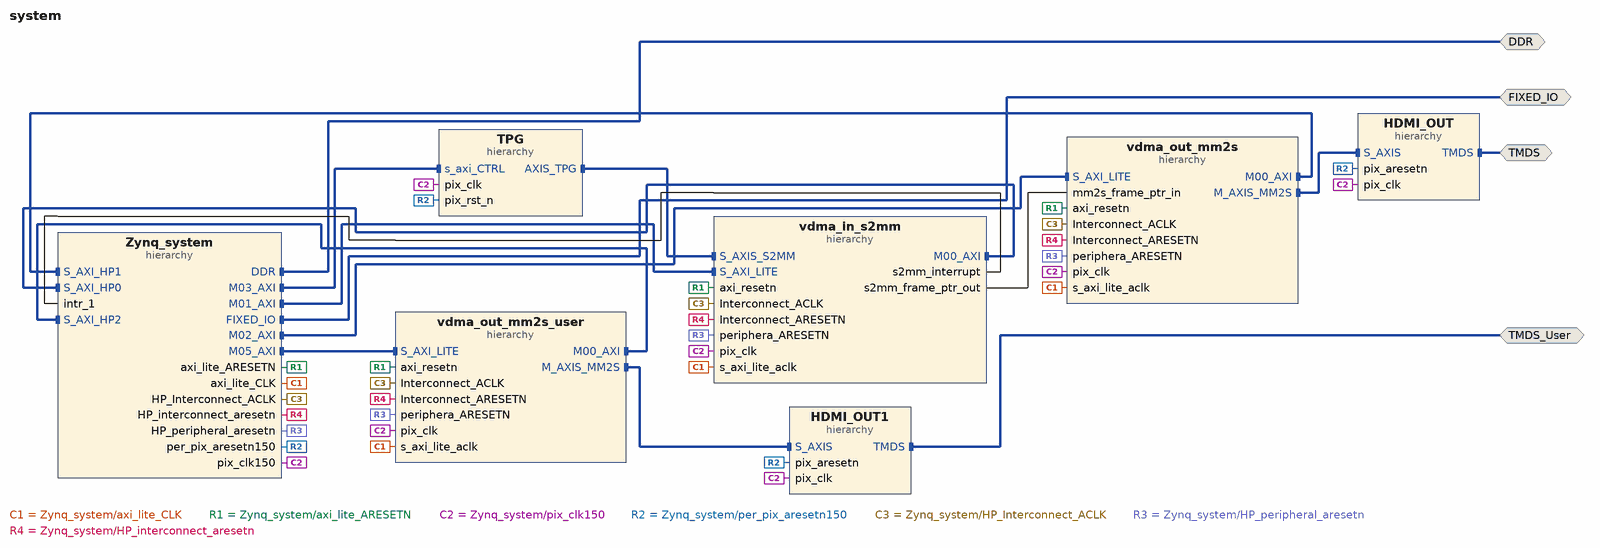
[diagram p0: block diagram of the top level]
# Vivado block design system, xc7z010clg400-1, Vivado 2018.3
create_bd_design system

create_bd_intf_port -mode Master -vlnv xilinx.com:interface:ddrx_rtl:1.0 DDR
create_bd_intf_port -mode Master -vlnv xilinx.com:display_processing_system7:fixedio_rtl:1.0 FIXED_IO
create_bd_intf_port -mode Master -vlnv digilentinc.com:interface:tmds_rtl:1.0 TMDS
create_bd_intf_port -mode Master -vlnv digilentinc.com:interface:tmds_rtl:1.0 TMDS_User

create_bd_cell -type hier vdma_in_s2mm
create_bd_cell -type hier vdma_out_mm2s
create_bd_cell -type hier Zynq_system
create_bd_cell -type hier TPG
create_bd_cell -type hier HDMI_OUT
create_bd_cell -type hier HDMI_OUT1
create_bd_cell -type hier vdma_out_mm2s_user

# ---- hierarchy /vdma_in_s2mm ----
current_bd_instance /vdma_in_s2mm
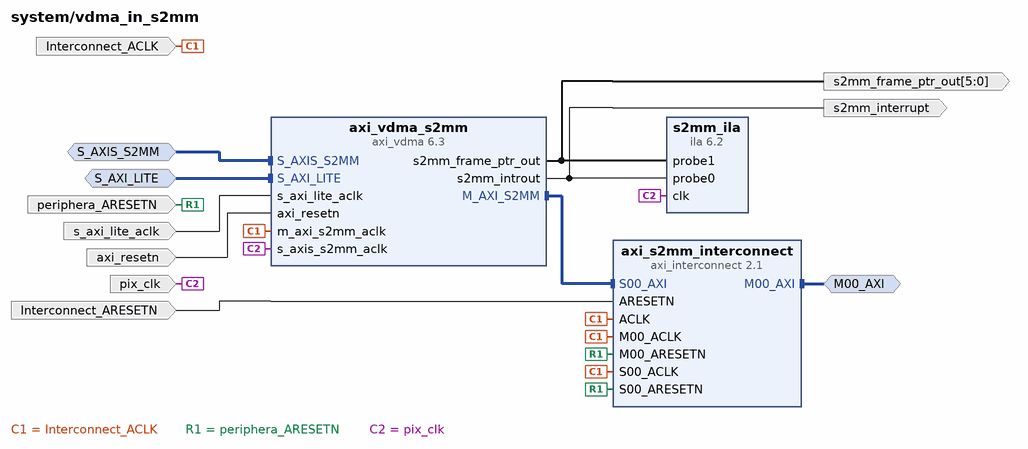
[diagram p1: block diagram inside /vdma_in_s2mm]
create_bd_intf_pin -mode Slave -vlnv xilinx.com:interface:axis_rtl:1.0 S_AXIS_S2MM
create_bd_intf_pin -mode Master -vlnv xilinx.com:interface:aximm_rtl:1.0 M00_AXI
create_bd_intf_pin -mode Slave -vlnv xilinx.com:interface:aximm_rtl:1.0 S_AXI_LITE
create_bd_pin -dir I -type clk Interconnect_ACLK
create_bd_pin -dir I -type rst periphera_ARESETN
create_bd_pin -dir I -type rst Interconnect_ARESETN
create_bd_pin -dir I -type clk s_axi_lite_aclk
create_bd_pin -dir I -type rst axi_resetn
create_bd_pin -dir I -type clk pix_clk
create_bd_pin -dir O -type intr s2mm_interrupt
create_bd_pin -dir O -from 5 -to 0 s2mm_frame_ptr_out

create_bd_cell -type ip -vlnv xilinx.com:ip:axi_vdma:6.3 axi_vdma_s2mm
set_property -dict [list \
  CONFIG.c_include_mm2s 0 \
  CONFIG.c_num_fstores 1 \
  CONFIG.c_s2mm_linebuffer_depth 2048 \
  CONFIG.c_s2mm_max_burst_length 64 \
] [get_bd_cells axi_vdma_s2mm]
create_bd_cell -type ip -vlnv xilinx.com:ip:axi_interconnect:2.1 axi_s2mm_interconnect
set_property -dict {CONFIG.NUM_MI 1} [get_bd_cells axi_s2mm_interconnect]
create_bd_cell -type ip -vlnv xilinx.com:ip:ila:6.2 s2mm_ila
set_property -dict [list \
  CONFIG.C_ENABLE_ILA_AXI_MON false \
  CONFIG.C_MONITOR_TYPE Native \
  CONFIG.C_NUM_OF_PROBES 2 \
  CONFIG.C_PROBE1_WIDTH 6 \
] [get_bd_cells s2mm_ila]

# ---- hierarchy /vdma_out_mm2s ----
current_bd_instance /vdma_out_mm2s
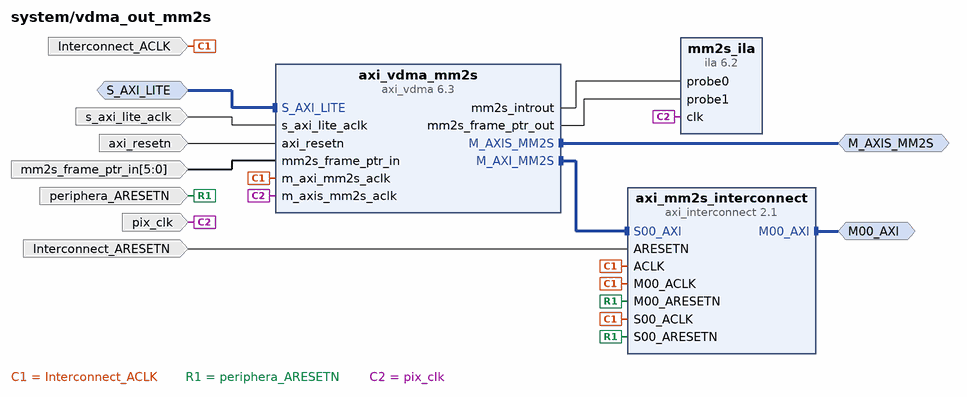
[diagram p2: block diagram inside /vdma_out_mm2s]
create_bd_intf_pin -mode Master -vlnv xilinx.com:interface:aximm_rtl:1.0 M00_AXI
create_bd_intf_pin -mode Slave -vlnv xilinx.com:interface:aximm_rtl:1.0 S_AXI_LITE
create_bd_intf_pin -mode Master -vlnv xilinx.com:interface:axis_rtl:1.0 M_AXIS_MM2S
create_bd_pin -dir I -type clk Interconnect_ACLK
create_bd_pin -dir I -type rst periphera_ARESETN
create_bd_pin -dir I -type rst Interconnect_ARESETN
create_bd_pin -dir I -type clk s_axi_lite_aclk
create_bd_pin -dir I -type rst axi_resetn
create_bd_pin -dir I -type clk pix_clk
create_bd_pin -dir I -from 5 -to 0 -type intr mm2s_frame_ptr_in

create_bd_cell -type ip -vlnv xilinx.com:ip:axi_vdma:6.3 axi_vdma_mm2s
set_property -dict [list \
  CONFIG.c_addr_width 32 \
  CONFIG.c_include_mm2s 1 \
  CONFIG.c_include_s2mm 0 \
  CONFIG.c_m_axis_mm2s_tdata_width 32 \
  CONFIG.c_mm2s_genlock_mode 3 \
  CONFIG.c_mm2s_linebuffer_depth 2048 \
  CONFIG.c_mm2s_max_burst_length 32 \
  CONFIG.c_num_fstores 1 \
] [get_bd_cells axi_vdma_mm2s]
create_bd_cell -type ip -vlnv xilinx.com:ip:axi_interconnect:2.1 axi_mm2s_interconnect
set_property -dict {CONFIG.NUM_MI 1} [get_bd_cells axi_mm2s_interconnect]
create_bd_cell -type ip -vlnv xilinx.com:ip:ila:6.2 mm2s_ila
set_property -dict [list \
  CONFIG.C_ENABLE_ILA_AXI_MON false \
  CONFIG.C_MONITOR_TYPE Native \
  CONFIG.C_NUM_OF_PROBES 2 \
  CONFIG.C_PROBE1_WIDTH 6 \
] [get_bd_cells mm2s_ila]

# ---- hierarchy /Zynq_system ----
current_bd_instance /Zynq_system
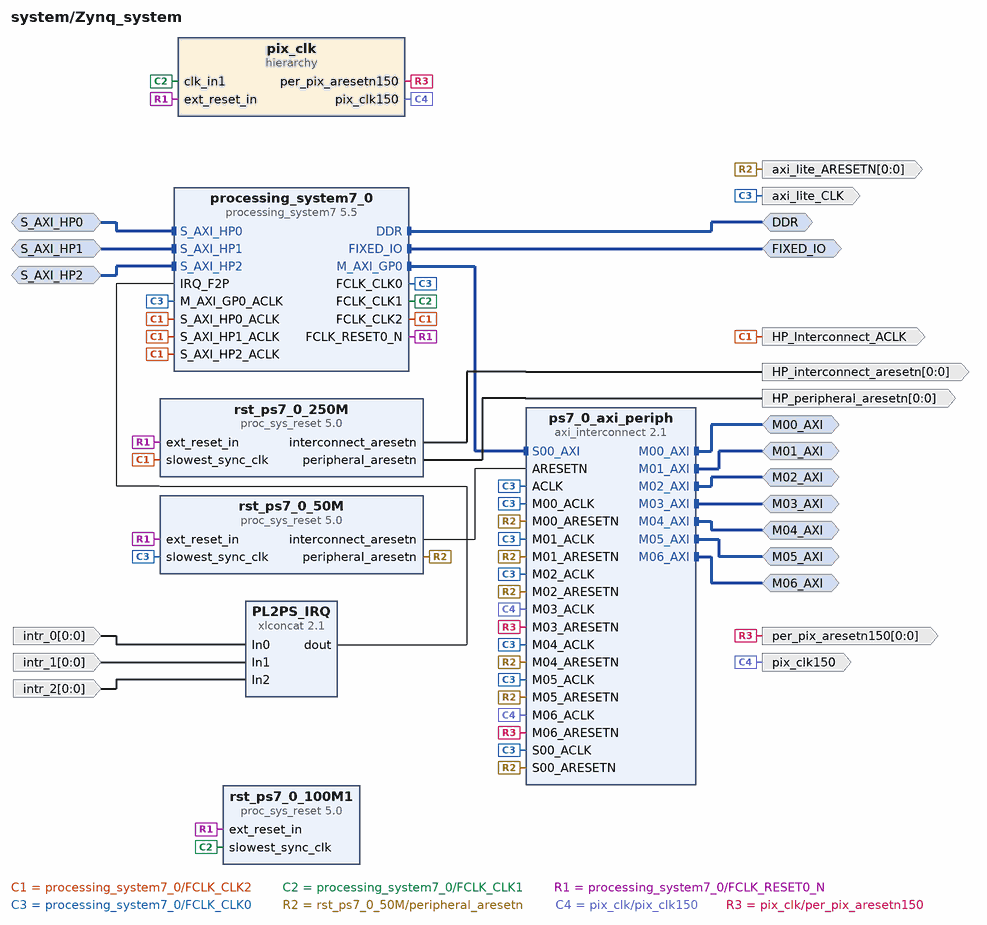
[diagram p3: block diagram inside /Zynq_system]
create_bd_intf_pin -mode Master -vlnv xilinx.com:interface:ddrx_rtl:1.0 DDR
create_bd_intf_pin -mode Master -vlnv xilinx.com:display_processing_system7:fixedio_rtl:1.0 FIXED_IO
create_bd_intf_pin -mode Master -vlnv xilinx.com:interface:aximm_rtl:1.0 M00_AXI
create_bd_intf_pin -mode Slave -vlnv xilinx.com:interface:aximm_rtl:1.0 S_AXI_HP0
create_bd_intf_pin -mode Slave -vlnv xilinx.com:interface:aximm_rtl:1.0 S_AXI_HP1
create_bd_intf_pin -mode Master -vlnv xilinx.com:interface:aximm_rtl:1.0 M01_AXI
create_bd_intf_pin -mode Master -vlnv xilinx.com:interface:aximm_rtl:1.0 M02_AXI
create_bd_intf_pin -mode Master -vlnv xilinx.com:interface:aximm_rtl:1.0 M03_AXI
create_bd_intf_pin -mode Slave -vlnv xilinx.com:interface:aximm_rtl:1.0 S_AXI_HP2
create_bd_intf_pin -mode Master -vlnv xilinx.com:interface:aximm_rtl:1.0 M04_AXI
create_bd_intf_pin -mode Master -vlnv xilinx.com:interface:aximm_rtl:1.0 M05_AXI
create_bd_intf_pin -mode Master -vlnv xilinx.com:interface:aximm_rtl:1.0 M06_AXI
create_bd_pin -dir O -type clk axi_lite_CLK
create_bd_pin -dir I -from 0 -to 0 intr_0
create_bd_pin -dir O -from 0 -to 0 -type rst axi_lite_ARESETN
create_bd_pin -dir O -type clk pix_clk150
create_bd_pin -dir O -from 0 -to 0 -type rst per_pix_aresetn150
create_bd_pin -dir O -type clk HP_Interconnect_ACLK
create_bd_pin -dir O -from 0 -to 0 -type rst HP_peripheral_aresetn
create_bd_pin -dir O -from 0 -to 0 -type rst HP_interconnect_aresetn
create_bd_pin -dir I -from 0 -to 0 intr_1
create_bd_pin -dir I -from 0 -to 0 intr_2

create_bd_cell -type ip -vlnv xilinx.com:ip:processing_system7:5.5 processing_system7_0
set_property -dict [list \
  CONFIG.PCW_ENET0_ENET0_IO {MIO 16 .. 27} \
  CONFIG.PCW_ENET0_GRP_MDIO_ENABLE 1 \
  CONFIG.PCW_ENET0_GRP_MDIO_IO {MIO 52 .. 53} \
  CONFIG.PCW_ENET0_PERIPHERAL_ENABLE 1 \
  CONFIG.PCW_ENET0_RESET_ENABLE 0 \
  CONFIG.PCW_ENET_RESET_ENABLE 1 \
  CONFIG.PCW_ENET_RESET_SELECT {Share reset pin} \
  CONFIG.PCW_EN_CLK1_PORT 1 \
  CONFIG.PCW_EN_CLK2_PORT 1 \
  CONFIG.PCW_FCLK_CLK1_BUF TRUE \
  CONFIG.PCW_FCLK_CLK2_BUF TRUE \
  CONFIG.PCW_FPGA1_PERIPHERAL_FREQMHZ 100 \
  CONFIG.PCW_FPGA2_PERIPHERAL_FREQMHZ 250 \
  CONFIG.PCW_FPGA_FCLK1_ENABLE 1 \
  CONFIG.PCW_FPGA_FCLK2_ENABLE 1 \
  CONFIG.PCW_GPIO_MIO_GPIO_ENABLE 1 \
  CONFIG.PCW_GPIO_MIO_GPIO_IO MIO \
  CONFIG.PCW_I2C_RESET_ENABLE 1 \
  CONFIG.PCW_IRQ_F2P_INTR 1 \
  CONFIG.PCW_PRESET_BANK1_VOLTAGE {LVCMOS 1.8V} \
  CONFIG.PCW_QSPI_GRP_FBCLK_ENABLE 1 \
  CONFIG.PCW_QSPI_GRP_FBCLK_IO {MIO 8} \
  CONFIG.PCW_QSPI_GRP_SINGLE_SS_ENABLE 1 \
  CONFIG.PCW_QSPI_GRP_SINGLE_SS_IO {MIO 1 .. 6} \
  CONFIG.PCW_QSPI_PERIPHERAL_ENABLE 1 \
  CONFIG.PCW_QSPI_QSPI_IO {MIO 1 .. 6} \
  CONFIG.PCW_SD0_GRP_CD_ENABLE 1 \
  CONFIG.PCW_SD0_GRP_CD_IO {MIO 47} \
  CONFIG.PCW_SD0_GRP_WP_ENABLE 0 \
  CONFIG.PCW_SD0_PERIPHERAL_ENABLE 1 \
  CONFIG.PCW_SD0_SD0_IO {MIO 40 .. 45} \
  CONFIG.PCW_SDIO_PERIPHERAL_FREQMHZ 100 \
  CONFIG.PCW_SINGLE_QSPI_DATA_MODE x4 \
  CONFIG.PCW_UART1_PERIPHERAL_ENABLE 1 \
  CONFIG.PCW_UART1_UART1_IO {MIO 48 .. 49} \
  CONFIG.PCW_UART_PERIPHERAL_FREQMHZ 100 \
  CONFIG.PCW_UIPARAM_DDR_FREQ_MHZ 533.333333 \
  CONFIG.PCW_UIPARAM_DDR_MEMORY_TYPE {DDR 3 (Low Voltage)} \
  CONFIG.PCW_UIPARAM_DDR_PARTNO {MT41K256M16 RE-125} \
  CONFIG.PCW_USB0_PERIPHERAL_ENABLE 1 \
  CONFIG.PCW_USB0_RESET_ENABLE 1 \
  CONFIG.PCW_USB0_RESET_IO {MIO 46} \
  CONFIG.PCW_USB0_USB0_IO {MIO 28 .. 39} \
  CONFIG.PCW_USB_RESET_ENABLE 1 \
  CONFIG.PCW_USB_RESET_SELECT {Share reset pin} \
  CONFIG.PCW_USE_FABRIC_INTERRUPT 1 \
  CONFIG.PCW_USE_S_AXI_HP0 1 \
  CONFIG.PCW_USE_S_AXI_HP1 1 \
  CONFIG.PCW_USE_S_AXI_HP2 1 \
] [get_bd_cells processing_system7_0]
# 208 more settings of processing_system7_0 are not shown: defaults, MIO pin electricals, DDR timing, and values the tool derives
create_bd_cell -type ip -vlnv xilinx.com:ip:xlconcat:2.1 PL2PS_IRQ
set_property -dict {CONFIG.NUM_PORTS 4} [get_bd_cells PL2PS_IRQ]
create_bd_cell -type ip -vlnv xilinx.com:ip:proc_sys_reset:5.0 rst_ps7_0_50M
create_bd_cell -type ip -vlnv xilinx.com:ip:axi_interconnect:2.1 ps7_0_axi_periph
set_property -dict {CONFIG.NUM_MI 7} [get_bd_cells ps7_0_axi_periph]
create_bd_cell -type ip -vlnv xilinx.com:ip:proc_sys_reset:5.0 rst_ps7_0_250M
create_bd_cell -type ip -vlnv xilinx.com:ip:proc_sys_reset:5.0 rst_ps7_0_100M1
create_bd_cell -type hier pix_clk

# ---- hierarchy /Zynq_system/pix_clk ----
current_bd_instance /Zynq_system/pix_clk
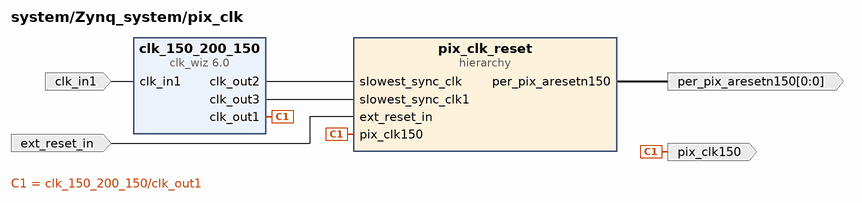
[diagram p4: block diagram inside /Zynq_system/pix_clk]
create_bd_pin -dir I -type clk clk_in1
create_bd_pin -dir O -type clk pix_clk150
create_bd_pin -dir I -type rst ext_reset_in
create_bd_pin -dir O -from 0 -to 0 -type rst per_pix_aresetn150

create_bd_cell -type ip -vlnv xilinx.com:ip:clk_wiz:6.0 clk_150_200_150
set_property -dict [list \
  CONFIG.CLKOUT1_JITTER 139.594 \
  CONFIG.CLKOUT1_PHASE_ERROR 132.063 \
  CONFIG.CLKOUT1_REQUESTED_OUT_FREQ 150.000 \
  CONFIG.CLKOUT2_JITTER 132.221 \
  CONFIG.CLKOUT2_PHASE_ERROR 132.063 \
  CONFIG.CLKOUT2_REQUESTED_OUT_FREQ 200.000 \
  CONFIG.CLKOUT2_USED true \
  CONFIG.CLKOUT3_JITTER 122.522 \
  CONFIG.CLKOUT3_PHASE_ERROR 132.063 \
  CONFIG.CLKOUT3_REQUESTED_OUT_FREQ 300.000 \
  CONFIG.CLKOUT3_USED true \
  CONFIG.MMCM_CLKFBOUT_MULT_F 6.000 \
  CONFIG.MMCM_CLKIN1_PERIOD 10.0 \
  CONFIG.MMCM_CLKIN2_PERIOD 10.0 \
  CONFIG.MMCM_CLKOUT0_DIVIDE_F 4.000 \
  CONFIG.MMCM_CLKOUT1_DIVIDE 3 \
  CONFIG.MMCM_CLKOUT2_DIVIDE 2 \
  CONFIG.MMCM_DIVCLK_DIVIDE 1 \
  CONFIG.NUM_OUT_CLKS 3 \
  CONFIG.USE_LOCKED false \
  CONFIG.USE_RESET false \
] [get_bd_cells clk_150_200_150]
create_bd_cell -type hier pix_clk_reset

# ---- hierarchy /Zynq_system/pix_clk/pix_clk_reset ----
current_bd_instance /Zynq_system/pix_clk/pix_clk_reset
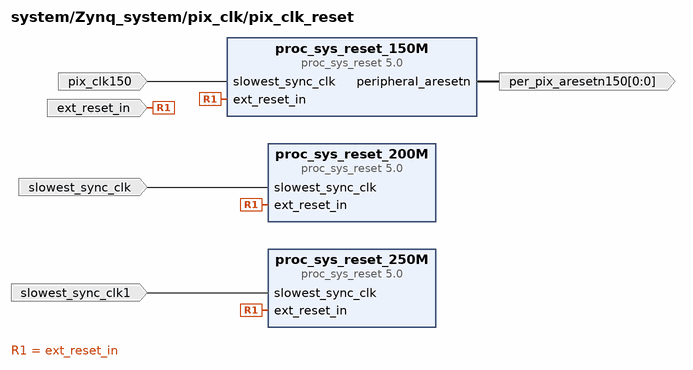
[diagram p5: block diagram inside /Zynq_system/pix_clk/pix_clk_reset]
create_bd_pin -dir I -type clk slowest_sync_clk
create_bd_pin -dir I -type rst ext_reset_in
create_bd_pin -dir I -type clk pix_clk150
create_bd_pin -dir O -from 0 -to 0 -type rst per_pix_aresetn150
create_bd_pin -dir I -type clk slowest_sync_clk1

create_bd_cell -type ip -vlnv xilinx.com:ip:proc_sys_reset:5.0 proc_sys_reset_200M
create_bd_cell -type ip -vlnv xilinx.com:ip:proc_sys_reset:5.0 proc_sys_reset_150M
create_bd_cell -type ip -vlnv xilinx.com:ip:proc_sys_reset:5.0 proc_sys_reset_250M

# ---- hierarchy /TPG ----
current_bd_instance /TPG
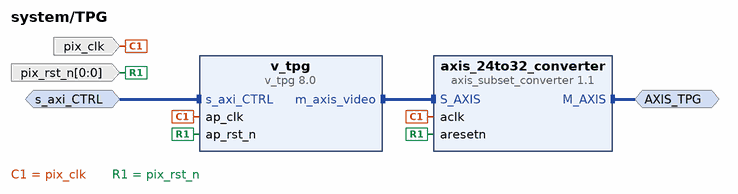
[diagram p6: block diagram inside /TPG]
create_bd_intf_pin -mode Master -vlnv xilinx.com:interface:axis_rtl:1.0 AXIS_TPG
create_bd_intf_pin -mode Slave -vlnv xilinx.com:interface:aximm_rtl:1.0 s_axi_CTRL
create_bd_pin -dir I -type clk pix_clk
create_bd_pin -dir I -from 0 -to 0 -type rst pix_rst_n

create_bd_cell -type ip -vlnv xilinx.com:ip:axis_subset_converter:1.1 axis_24to32_converter
set_property -dict [list \
  CONFIG.M_TDATA_NUM_BYTES 4 \
  CONFIG.S_TDATA_NUM_BYTES 3 \
  CONFIG.TDATA_REMAP {8'b00000000,tdata[23:0]} \
] [get_bd_cells axis_24to32_converter]
create_bd_cell -type ip -vlnv xilinx.com:ip:v_tpg:8.0 v_tpg
set_property -dict [list \
  CONFIG.FOREGROUND 1 \
  CONFIG.HAS_AXI4S_SLAVE 0 \
  CONFIG.MAX_COLS 1920 \
  CONFIG.MAX_DATA_WIDTH 8 \
  CONFIG.MAX_ROWS 1080 \
  CONFIG.SAMPLES_PER_CLOCK 1 \
] [get_bd_cells v_tpg]

# ---- hierarchy /HDMI_OUT ----
current_bd_instance /HDMI_OUT
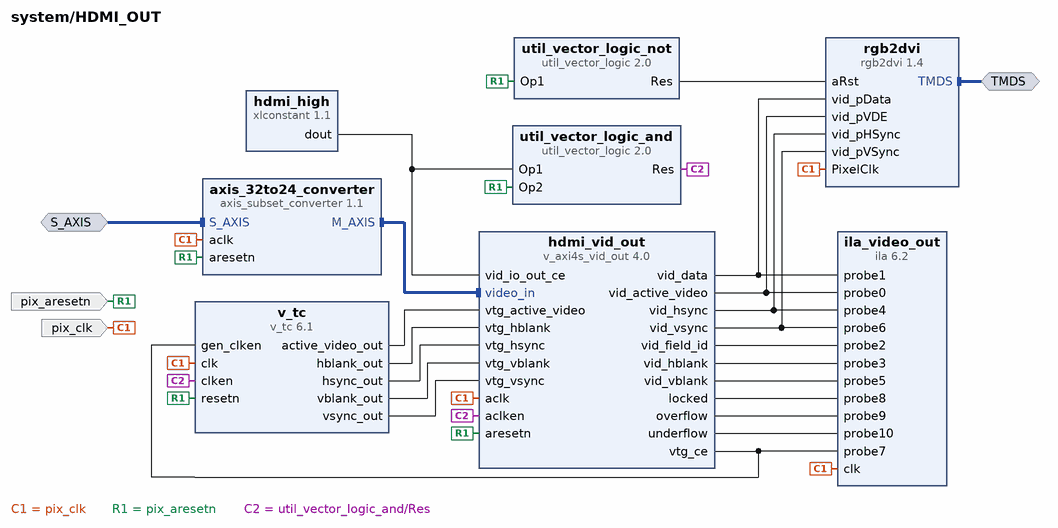
[diagram p7: block diagram inside /HDMI_OUT]
create_bd_intf_pin -mode Master -vlnv digilentinc.com:interface:tmds_rtl:1.0 TMDS
create_bd_intf_pin -mode Slave -vlnv xilinx.com:interface:axis_rtl:1.0 S_AXIS
create_bd_pin -dir I -type clk pix_clk
create_bd_pin -dir I -type rst pix_aresetn

create_bd_cell -type ip -vlnv xilinx.com:ip:axis_subset_converter:1.1 axis_32to24_converter
set_property -dict [list \
  CONFIG.M_TDATA_NUM_BYTES 3 \
  CONFIG.S_TDATA_NUM_BYTES 4 \
  CONFIG.TDATA_REMAP {tdata[23:0]} \
] [get_bd_cells axis_32to24_converter]
create_bd_cell -type ip -vlnv xilinx.com:ip:v_axi4s_vid_out:4.0 hdmi_vid_out
set_property -dict {CONFIG.C_VTG_MASTER_SLAVE 0} [get_bd_cells hdmi_vid_out]
create_bd_cell -type ip -vlnv xilinx.com:ip:v_tc:6.1 v_tc
set_property -dict [list \
  CONFIG.HAS_AXI4_LITE false \
  CONFIG.HAS_INTC_IF false \
  CONFIG.VIDEO_MODE 1080p \
  CONFIG.enable_detection false \
  CONFIG.enable_generation true \
] [get_bd_cells v_tc]
create_bd_cell -type ip -vlnv digilentinc.com:ip:rgb2dvi:1.4 rgb2dvi
create_bd_cell -type ip -vlnv xilinx.com:ip:util_vector_logic:2.0 util_vector_logic_not
set_property -dict {CONFIG.C_OPERATION not CONFIG.C_SIZE 1} [get_bd_cells util_vector_logic_not]
create_bd_cell -type ip -vlnv xilinx.com:ip:util_vector_logic:2.0 util_vector_logic_and
set_property -dict {CONFIG.C_SIZE 1} [get_bd_cells util_vector_logic_and]
create_bd_cell -type ip -vlnv xilinx.com:ip:xlconstant:1.1 hdmi_high
create_bd_cell -type ip -vlnv xilinx.com:ip:ila:6.2 ila_video_out
set_property -dict [list \
  CONFIG.C_DATA_DEPTH 1024 \
  CONFIG.C_ENABLE_ILA_AXI_MON false \
  CONFIG.C_MONITOR_TYPE Native \
  CONFIG.C_NUM_OF_PROBES 11 \
  CONFIG.C_PROBE1_WIDTH 24 \
] [get_bd_cells ila_video_out]

# ---- hierarchy /HDMI_OUT1 ----
current_bd_instance /HDMI_OUT1
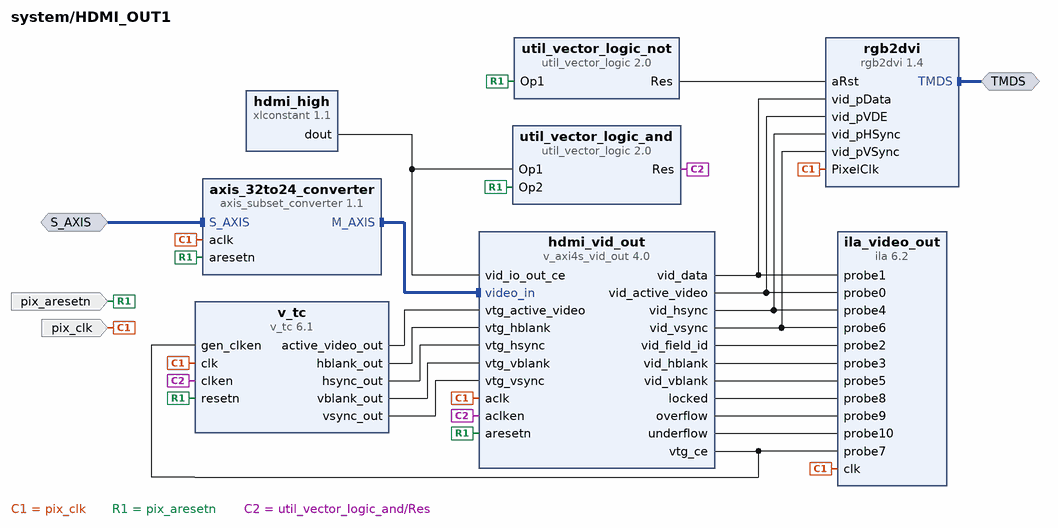
[diagram p8: block diagram inside /HDMI_OUT1]
create_bd_intf_pin -mode Master -vlnv digilentinc.com:interface:tmds_rtl:1.0 TMDS
create_bd_intf_pin -mode Slave -vlnv xilinx.com:interface:axis_rtl:1.0 S_AXIS
create_bd_pin -dir I -type clk pix_clk
create_bd_pin -dir I -type rst pix_aresetn

create_bd_cell -type ip -vlnv xilinx.com:ip:axis_subset_converter:1.1 axis_32to24_converter
set_property -dict [list \
  CONFIG.M_TDATA_NUM_BYTES 3 \
  CONFIG.S_TDATA_NUM_BYTES 4 \
  CONFIG.TDATA_REMAP {tdata[23:0]} \
] [get_bd_cells axis_32to24_converter]
create_bd_cell -type ip -vlnv xilinx.com:ip:v_axi4s_vid_out:4.0 hdmi_vid_out
set_property -dict {CONFIG.C_VTG_MASTER_SLAVE 0} [get_bd_cells hdmi_vid_out]
create_bd_cell -type ip -vlnv xilinx.com:ip:v_tc:6.1 v_tc
set_property -dict [list \
  CONFIG.HAS_AXI4_LITE false \
  CONFIG.HAS_INTC_IF false \
  CONFIG.VIDEO_MODE 1080p \
  CONFIG.enable_detection false \
  CONFIG.enable_generation true \
] [get_bd_cells v_tc]
create_bd_cell -type ip -vlnv digilentinc.com:ip:rgb2dvi:1.4 rgb2dvi
create_bd_cell -type ip -vlnv xilinx.com:ip:util_vector_logic:2.0 util_vector_logic_not
set_property -dict {CONFIG.C_OPERATION not CONFIG.C_SIZE 1} [get_bd_cells util_vector_logic_not]
create_bd_cell -type ip -vlnv xilinx.com:ip:util_vector_logic:2.0 util_vector_logic_and
set_property -dict {CONFIG.C_SIZE 1} [get_bd_cells util_vector_logic_and]
create_bd_cell -type ip -vlnv xilinx.com:ip:xlconstant:1.1 hdmi_high
create_bd_cell -type ip -vlnv xilinx.com:ip:ila:6.2 ila_video_out
set_property -dict [list \
  CONFIG.C_DATA_DEPTH 1024 \
  CONFIG.C_ENABLE_ILA_AXI_MON false \
  CONFIG.C_MONITOR_TYPE Native \
  CONFIG.C_NUM_OF_PROBES 11 \
  CONFIG.C_PROBE1_WIDTH 24 \
] [get_bd_cells ila_video_out]

# ---- hierarchy /vdma_out_mm2s_user ----
current_bd_instance /vdma_out_mm2s_user
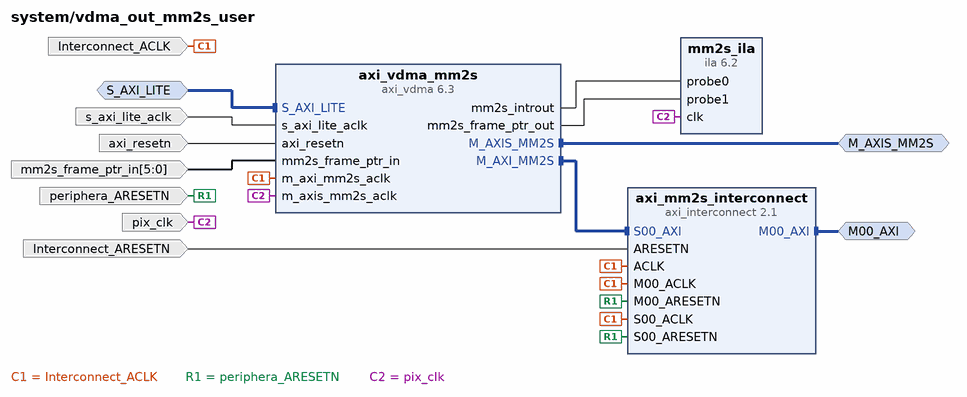
[diagram p9: block diagram inside /vdma_out_mm2s_user]
create_bd_intf_pin -mode Master -vlnv xilinx.com:interface:aximm_rtl:1.0 M00_AXI
create_bd_intf_pin -mode Slave -vlnv xilinx.com:interface:aximm_rtl:1.0 S_AXI_LITE
create_bd_intf_pin -mode Master -vlnv xilinx.com:interface:axis_rtl:1.0 M_AXIS_MM2S
create_bd_pin -dir I -type clk Interconnect_ACLK
create_bd_pin -dir I -type rst periphera_ARESETN
create_bd_pin -dir I -type rst Interconnect_ARESETN
create_bd_pin -dir I -type clk s_axi_lite_aclk
create_bd_pin -dir I -type rst axi_resetn
create_bd_pin -dir I -type clk pix_clk
create_bd_pin -dir I -from 5 -to 0 -type intr mm2s_frame_ptr_in

create_bd_cell -type ip -vlnv xilinx.com:ip:axi_vdma:6.3 axi_vdma_mm2s
set_property -dict [list \
  CONFIG.c_addr_width 32 \
  CONFIG.c_include_mm2s 1 \
  CONFIG.c_include_s2mm 0 \
  CONFIG.c_m_axis_mm2s_tdata_width 32 \
  CONFIG.c_mm2s_genlock_mode 3 \
  CONFIG.c_mm2s_linebuffer_depth 2048 \
  CONFIG.c_mm2s_max_burst_length 32 \
  CONFIG.c_num_fstores 1 \
] [get_bd_cells axi_vdma_mm2s]
create_bd_cell -type ip -vlnv xilinx.com:ip:axi_interconnect:2.1 axi_mm2s_interconnect
set_property -dict {CONFIG.NUM_MI 1} [get_bd_cells axi_mm2s_interconnect]
create_bd_cell -type ip -vlnv xilinx.com:ip:ila:6.2 mm2s_ila
set_property -dict [list \
  CONFIG.C_ENABLE_ILA_AXI_MON false \
  CONFIG.C_MONITOR_TYPE Native \
  CONFIG.C_NUM_OF_PROBES 2 \
  CONFIG.C_PROBE1_WIDTH 6 \
] [get_bd_cells mm2s_ila]

# ---- connections ----

current_bd_instance /vdma_in_s2mm
connect_bd_intf_net [get_bd_intf_pins S_AXIS_S2MM] [get_bd_intf_pins axi_vdma_s2mm/S_AXIS_S2MM]
connect_bd_intf_net [get_bd_intf_pins M00_AXI] [get_bd_intf_pins axi_s2mm_interconnect/M00_AXI]
connect_bd_intf_net [get_bd_intf_pins S_AXI_LITE] [get_bd_intf_pins axi_vdma_s2mm/S_AXI_LITE]
connect_bd_intf_net [get_bd_intf_pins axi_vdma_s2mm/M_AXI_S2MM] [get_bd_intf_pins axi_s2mm_interconnect/S00_AXI]
connect_bd_net [get_bd_pins axi_vdma_s2mm/s2mm_introut] [get_bd_pins s2mm_ila/probe0] [get_bd_pins s2mm_interrupt]
connect_bd_net [get_bd_pins axi_vdma_s2mm/s2mm_frame_ptr_out] [get_bd_pins s2mm_ila/probe1] [get_bd_pins s2mm_frame_ptr_out]
connect_bd_net -net ACLK_1 [get_bd_pins Interconnect_ACLK] \
  [get_bd_pins axi_s2mm_interconnect/ACLK] [get_bd_pins axi_s2mm_interconnect/S00_ACLK] \
  [get_bd_pins axi_s2mm_interconnect/M00_ACLK] [get_bd_pins axi_vdma_s2mm/m_axi_s2mm_aclk]
connect_bd_net -net S00_ARESETN_1 [get_bd_pins periphera_ARESETN] \
  [get_bd_pins axi_s2mm_interconnect/S00_ARESETN] [get_bd_pins axi_s2mm_interconnect/M00_ARESETN]
connect_bd_net -net ARESETN_1 [get_bd_pins Interconnect_ARESETN] [get_bd_pins axi_s2mm_interconnect/ARESETN]
connect_bd_net [get_bd_pins s_axi_lite_aclk] [get_bd_pins axi_vdma_s2mm/s_axi_lite_aclk]
connect_bd_net [get_bd_pins axi_resetn] [get_bd_pins axi_vdma_s2mm/axi_resetn]
connect_bd_net -net s_axis_s2mm_aclk_1 [get_bd_pins pix_clk] [get_bd_pins axi_vdma_s2mm/s_axis_s2mm_aclk] [get_bd_pins s2mm_ila/clk]

current_bd_instance /vdma_out_mm2s
connect_bd_intf_net [get_bd_intf_pins axi_vdma_mm2s/M_AXI_MM2S] [get_bd_intf_pins axi_mm2s_interconnect/S00_AXI]
connect_bd_intf_net [get_bd_intf_pins M_AXIS_MM2S] [get_bd_intf_pins axi_vdma_mm2s/M_AXIS_MM2S]
connect_bd_intf_net [get_bd_intf_pins S_AXI_LITE] [get_bd_intf_pins axi_vdma_mm2s/S_AXI_LITE]
connect_bd_intf_net [get_bd_intf_pins M00_AXI] [get_bd_intf_pins axi_mm2s_interconnect/M00_AXI]
connect_bd_net [get_bd_pins axi_vdma_mm2s/mm2s_introut] [get_bd_pins mm2s_ila/probe0]
connect_bd_net [get_bd_pins axi_vdma_mm2s/mm2s_frame_ptr_out] [get_bd_pins mm2s_ila/probe1]
connect_bd_net -net ACLK_1 [get_bd_pins Interconnect_ACLK] \
  [get_bd_pins axi_mm2s_interconnect/ACLK] [get_bd_pins axi_mm2s_interconnect/S00_ACLK] \
  [get_bd_pins axi_mm2s_interconnect/M00_ACLK] [get_bd_pins axi_vdma_mm2s/m_axi_mm2s_aclk]
connect_bd_net -net M00_ARESETN_1 [get_bd_pins periphera_ARESETN] \
  [get_bd_pins axi_mm2s_interconnect/M00_ARESETN] [get_bd_pins axi_mm2s_interconnect/S00_ARESETN]
connect_bd_net -net ARESETN_1 [get_bd_pins Interconnect_ARESETN] [get_bd_pins axi_mm2s_interconnect/ARESETN]
connect_bd_net [get_bd_pins s_axi_lite_aclk] [get_bd_pins axi_vdma_mm2s/s_axi_lite_aclk]
connect_bd_net [get_bd_pins axi_resetn] [get_bd_pins axi_vdma_mm2s/axi_resetn]
connect_bd_net -net m_axis_mm2s_aclk_1 [get_bd_pins pix_clk] [get_bd_pins axi_vdma_mm2s/m_axis_mm2s_aclk] [get_bd_pins mm2s_ila/clk]
connect_bd_net [get_bd_pins mm2s_frame_ptr_in] [get_bd_pins axi_vdma_mm2s/mm2s_frame_ptr_in]

current_bd_instance /Zynq_system
connect_bd_intf_net [get_bd_intf_pins M00_AXI] [get_bd_intf_pins ps7_0_axi_periph/M00_AXI]
connect_bd_intf_net -intf_net S_AXI_HP0_1 [get_bd_intf_pins S_AXI_HP0] [get_bd_intf_pins processing_system7_0/S_AXI_HP0]
connect_bd_intf_net [get_bd_intf_pins DDR] [get_bd_intf_pins processing_system7_0/DDR]
connect_bd_intf_net [get_bd_intf_pins M03_AXI] [get_bd_intf_pins ps7_0_axi_periph/M03_AXI]
connect_bd_intf_net [get_bd_intf_pins processing_system7_0/M_AXI_GP0] [get_bd_intf_pins ps7_0_axi_periph/S00_AXI]
connect_bd_intf_net -intf_net S_AXI_HP1_1 [get_bd_intf_pins S_AXI_HP1] [get_bd_intf_pins processing_system7_0/S_AXI_HP1]
connect_bd_intf_net [get_bd_intf_pins FIXED_IO] [get_bd_intf_pins processing_system7_0/FIXED_IO]
connect_bd_intf_net [get_bd_intf_pins M02_AXI] [get_bd_intf_pins ps7_0_axi_periph/M02_AXI]
connect_bd_intf_net [get_bd_intf_pins M01_AXI] [get_bd_intf_pins ps7_0_axi_periph/M01_AXI]
connect_bd_intf_net [get_bd_intf_pins S_AXI_HP2] [get_bd_intf_pins processing_system7_0/S_AXI_HP2]
connect_bd_intf_net [get_bd_intf_pins M04_AXI] [get_bd_intf_pins ps7_0_axi_periph/M04_AXI]
connect_bd_intf_net [get_bd_intf_pins M05_AXI] [get_bd_intf_pins ps7_0_axi_periph/M05_AXI]
connect_bd_intf_net [get_bd_intf_pins M06_AXI] [get_bd_intf_pins ps7_0_axi_periph/M06_AXI]
connect_bd_net [get_bd_pins processing_system7_0/FCLK_CLK2] \
  [get_bd_pins processing_system7_0/S_AXI_HP0_ACLK] [get_bd_pins processing_system7_0/S_AXI_HP1_ACLK] \
  [get_bd_pins rst_ps7_0_250M/slowest_sync_clk] [get_bd_pins HP_Interconnect_ACLK] \
  [get_bd_pins processing_system7_0/S_AXI_HP2_ACLK]
connect_bd_net [get_bd_pins PL2PS_IRQ/dout] [get_bd_pins processing_system7_0/IRQ_F2P]
connect_bd_net [get_bd_pins processing_system7_0/FCLK_CLK1] [get_bd_pins rst_ps7_0_100M1/slowest_sync_clk] [get_bd_pins pix_clk/clk_in1]
connect_bd_net [get_bd_pins processing_system7_0/FCLK_RESET0_N] \
  [get_bd_pins rst_ps7_0_50M/ext_reset_in] [get_bd_pins rst_ps7_0_100M1/ext_reset_in] \
  [get_bd_pins rst_ps7_0_250M/ext_reset_in] [get_bd_pins pix_clk/ext_reset_in]
connect_bd_net [get_bd_pins processing_system7_0/FCLK_CLK0] \
  [get_bd_pins axi_lite_CLK] [get_bd_pins ps7_0_axi_periph/S00_ACLK] [get_bd_pins rst_ps7_0_50M/slowest_sync_clk] \
  [get_bd_pins ps7_0_axi_periph/M00_ACLK] [get_bd_pins ps7_0_axi_periph/ACLK] \
  [get_bd_pins processing_system7_0/M_AXI_GP0_ACLK] [get_bd_pins ps7_0_axi_periph/M02_ACLK] \
  [get_bd_pins ps7_0_axi_periph/M01_ACLK] [get_bd_pins ps7_0_axi_periph/M04_ACLK] [get_bd_pins ps7_0_axi_periph/M05_ACLK]
connect_bd_net -net PL_Switch_ip2intc_irpt [get_bd_pins intr_0] [get_bd_pins PL2PS_IRQ/In0]
connect_bd_net [get_bd_pins rst_ps7_0_50M/peripheral_aresetn] \
  [get_bd_pins axi_lite_ARESETN] [get_bd_pins ps7_0_axi_periph/S00_ARESETN] [get_bd_pins ps7_0_axi_periph/M00_ARESETN] \
  [get_bd_pins ps7_0_axi_periph/M01_ARESETN] [get_bd_pins ps7_0_axi_periph/M02_ARESETN] \
  [get_bd_pins ps7_0_axi_periph/M04_ARESETN] [get_bd_pins ps7_0_axi_periph/M05_ARESETN]
connect_bd_net -net clk_150_200_150_clk_out1 [get_bd_pins pix_clk/pix_clk150] \
  [get_bd_pins pix_clk150] [get_bd_pins ps7_0_axi_periph/M03_ACLK] [get_bd_pins ps7_0_axi_periph/M06_ACLK]
connect_bd_net -net proc_sys_reset_150M_peripheral_aresetn [get_bd_pins pix_clk/per_pix_aresetn150] \
  [get_bd_pins per_pix_aresetn150] [get_bd_pins ps7_0_axi_periph/M03_ARESETN] [get_bd_pins ps7_0_axi_periph/M06_ARESETN]
connect_bd_net [get_bd_pins rst_ps7_0_250M/peripheral_aresetn] [get_bd_pins HP_peripheral_aresetn]
connect_bd_net [get_bd_pins rst_ps7_0_250M/interconnect_aresetn] [get_bd_pins HP_interconnect_aresetn]
connect_bd_net -net ARESETN_1 [get_bd_pins rst_ps7_0_50M/interconnect_aresetn] [get_bd_pins ps7_0_axi_periph/ARESETN]
connect_bd_net -net In1_1 [get_bd_pins intr_1] [get_bd_pins PL2PS_IRQ/In1]
connect_bd_net -net In2_1 [get_bd_pins intr_2] [get_bd_pins PL2PS_IRQ/In2]

current_bd_instance /Zynq_system/pix_clk
connect_bd_net [get_bd_pins clk_150_200_150/clk_out2] [get_bd_pins pix_clk_reset/slowest_sync_clk]
connect_bd_net [get_bd_pins clk_150_200_150/clk_out3] [get_bd_pins pix_clk_reset/slowest_sync_clk1]
connect_bd_net -net processing_system7_0_FCLK_CLK1 [get_bd_pins clk_in1] [get_bd_pins clk_150_200_150/clk_in1]
connect_bd_net [get_bd_pins clk_150_200_150/clk_out1] [get_bd_pins pix_clk150] [get_bd_pins pix_clk_reset/pix_clk150]
connect_bd_net -net processing_system7_0_FCLK_RESET0_N [get_bd_pins ext_reset_in] [get_bd_pins pix_clk_reset/ext_reset_in]
connect_bd_net -net proc_sys_reset_150M_peripheral_aresetn [get_bd_pins pix_clk_reset/per_pix_aresetn150] [get_bd_pins per_pix_aresetn150]

current_bd_instance /Zynq_system/pix_clk/pix_clk_reset
connect_bd_net -net clk_150_200_150_clk_out2 [get_bd_pins slowest_sync_clk] [get_bd_pins proc_sys_reset_200M/slowest_sync_clk]
connect_bd_net -net processing_system7_0_FCLK_RESET0_N [get_bd_pins ext_reset_in] \
  [get_bd_pins proc_sys_reset_150M/ext_reset_in] [get_bd_pins proc_sys_reset_250M/ext_reset_in] \
  [get_bd_pins proc_sys_reset_200M/ext_reset_in]
connect_bd_net -net clk_150_200_150_clk_out1 [get_bd_pins pix_clk150] [get_bd_pins proc_sys_reset_150M/slowest_sync_clk]
connect_bd_net [get_bd_pins proc_sys_reset_150M/peripheral_aresetn] [get_bd_pins per_pix_aresetn150]
connect_bd_net -net clk_150_200_150_clk_out3 [get_bd_pins slowest_sync_clk1] [get_bd_pins proc_sys_reset_250M/slowest_sync_clk]

current_bd_instance /TPG
connect_bd_intf_net [get_bd_intf_pins s_axi_CTRL] [get_bd_intf_pins v_tpg/s_axi_CTRL]
connect_bd_intf_net [get_bd_intf_pins v_tpg/m_axis_video] [get_bd_intf_pins axis_24to32_converter/S_AXIS]
connect_bd_intf_net [get_bd_intf_pins AXIS_TPG] [get_bd_intf_pins axis_24to32_converter/M_AXIS]
connect_bd_net -net ap_clk_1 [get_bd_pins pix_clk] [get_bd_pins v_tpg/ap_clk] [get_bd_pins axis_24to32_converter/aclk]
connect_bd_net -net ap_rst_n_1 [get_bd_pins pix_rst_n] [get_bd_pins v_tpg/ap_rst_n] [get_bd_pins axis_24to32_converter/aresetn]

current_bd_instance /HDMI_OUT
connect_bd_intf_net [get_bd_intf_pins axis_32to24_converter/M_AXIS] [get_bd_intf_pins hdmi_vid_out/video_in]
connect_bd_intf_net [get_bd_intf_pins S_AXIS] [get_bd_intf_pins axis_32to24_converter/S_AXIS]
connect_bd_intf_net [get_bd_intf_pins TMDS] [get_bd_intf_pins rgb2dvi/TMDS]
connect_bd_net [get_bd_pins v_tc/active_video_out] [get_bd_pins hdmi_vid_out/vtg_active_video]
connect_bd_net [get_bd_pins v_tc/hblank_out] [get_bd_pins hdmi_vid_out/vtg_hblank]
connect_bd_net [get_bd_pins v_tc/hsync_out] [get_bd_pins hdmi_vid_out/vtg_hsync]
connect_bd_net [get_bd_pins v_tc/vblank_out] [get_bd_pins hdmi_vid_out/vtg_vblank]
connect_bd_net [get_bd_pins v_tc/vsync_out] [get_bd_pins hdmi_vid_out/vtg_vsync]
connect_bd_net [get_bd_pins hdmi_vid_out/vtg_ce] [get_bd_pins v_tc/gen_clken] [get_bd_pins ila_video_out/probe7]
connect_bd_net [get_bd_pins hdmi_vid_out/vid_data] [get_bd_pins rgb2dvi/vid_pData] [get_bd_pins ila_video_out/probe1]
connect_bd_net [get_bd_pins hdmi_vid_out/vid_active_video] [get_bd_pins rgb2dvi/vid_pVDE] [get_bd_pins ila_video_out/probe0]
connect_bd_net [get_bd_pins hdmi_vid_out/vid_hsync] [get_bd_pins rgb2dvi/vid_pHSync] [get_bd_pins ila_video_out/probe4]
connect_bd_net [get_bd_pins hdmi_vid_out/vid_vsync] [get_bd_pins rgb2dvi/vid_pVSync] [get_bd_pins ila_video_out/probe6]
connect_bd_net [get_bd_pins pix_clk] \
  [get_bd_pins rgb2dvi/PixelClk] [get_bd_pins hdmi_vid_out/aclk] [get_bd_pins v_tc/clk] \
  [get_bd_pins axis_32to24_converter/aclk] [get_bd_pins ila_video_out/clk]
connect_bd_net [get_bd_pins pix_aresetn] \
  [get_bd_pins axis_32to24_converter/aresetn] [get_bd_pins v_tc/resetn] [get_bd_pins hdmi_vid_out/aresetn] \
  [get_bd_pins util_vector_logic_not/Op1] [get_bd_pins util_vector_logic_and/Op2]
connect_bd_net [get_bd_pins util_vector_logic_not/Res] [get_bd_pins rgb2dvi/aRst]
connect_bd_net [get_bd_pins util_vector_logic_and/Res] [get_bd_pins v_tc/clken] [get_bd_pins hdmi_vid_out/aclken]
connect_bd_net [get_bd_pins hdmi_high/dout] [get_bd_pins util_vector_logic_and/Op1] [get_bd_pins hdmi_vid_out/vid_io_out_ce]
connect_bd_net [get_bd_pins hdmi_vid_out/vid_field_id] [get_bd_pins ila_video_out/probe2]
connect_bd_net [get_bd_pins hdmi_vid_out/vid_hblank] [get_bd_pins ila_video_out/probe3]
connect_bd_net [get_bd_pins hdmi_vid_out/vid_vblank] [get_bd_pins ila_video_out/probe5]
connect_bd_net [get_bd_pins hdmi_vid_out/locked] [get_bd_pins ila_video_out/probe8]
connect_bd_net [get_bd_pins hdmi_vid_out/overflow] [get_bd_pins ila_video_out/probe9]
connect_bd_net [get_bd_pins hdmi_vid_out/underflow] [get_bd_pins ila_video_out/probe10]

current_bd_instance /HDMI_OUT1
connect_bd_intf_net [get_bd_intf_pins S_AXIS] [get_bd_intf_pins axis_32to24_converter/S_AXIS]
connect_bd_intf_net [get_bd_intf_pins axis_32to24_converter/M_AXIS] [get_bd_intf_pins hdmi_vid_out/video_in]
connect_bd_intf_net [get_bd_intf_pins TMDS] [get_bd_intf_pins rgb2dvi/TMDS]
connect_bd_net [get_bd_pins v_tc/active_video_out] [get_bd_pins hdmi_vid_out/vtg_active_video]
connect_bd_net [get_bd_pins v_tc/hblank_out] [get_bd_pins hdmi_vid_out/vtg_hblank]
connect_bd_net [get_bd_pins v_tc/hsync_out] [get_bd_pins hdmi_vid_out/vtg_hsync]
connect_bd_net [get_bd_pins v_tc/vblank_out] [get_bd_pins hdmi_vid_out/vtg_vblank]
connect_bd_net [get_bd_pins v_tc/vsync_out] [get_bd_pins hdmi_vid_out/vtg_vsync]
connect_bd_net [get_bd_pins hdmi_vid_out/vtg_ce] [get_bd_pins v_tc/gen_clken] [get_bd_pins ila_video_out/probe7]
connect_bd_net [get_bd_pins hdmi_vid_out/vid_data] [get_bd_pins rgb2dvi/vid_pData] [get_bd_pins ila_video_out/probe1]
connect_bd_net [get_bd_pins hdmi_vid_out/vid_active_video] [get_bd_pins rgb2dvi/vid_pVDE] [get_bd_pins ila_video_out/probe0]
connect_bd_net [get_bd_pins hdmi_vid_out/vid_hsync] [get_bd_pins rgb2dvi/vid_pHSync] [get_bd_pins ila_video_out/probe4]
connect_bd_net [get_bd_pins hdmi_vid_out/vid_vsync] [get_bd_pins rgb2dvi/vid_pVSync] [get_bd_pins ila_video_out/probe6]
connect_bd_net [get_bd_pins pix_clk] \
  [get_bd_pins rgb2dvi/PixelClk] [get_bd_pins hdmi_vid_out/aclk] [get_bd_pins v_tc/clk] \
  [get_bd_pins axis_32to24_converter/aclk] [get_bd_pins ila_video_out/clk]
connect_bd_net [get_bd_pins pix_aresetn] \
  [get_bd_pins axis_32to24_converter/aresetn] [get_bd_pins v_tc/resetn] [get_bd_pins hdmi_vid_out/aresetn] \
  [get_bd_pins util_vector_logic_not/Op1] [get_bd_pins util_vector_logic_and/Op2]
connect_bd_net [get_bd_pins util_vector_logic_not/Res] [get_bd_pins rgb2dvi/aRst]
connect_bd_net [get_bd_pins util_vector_logic_and/Res] [get_bd_pins v_tc/clken] [get_bd_pins hdmi_vid_out/aclken]
connect_bd_net [get_bd_pins hdmi_high/dout] [get_bd_pins util_vector_logic_and/Op1] [get_bd_pins hdmi_vid_out/vid_io_out_ce]
connect_bd_net [get_bd_pins hdmi_vid_out/vid_field_id] [get_bd_pins ila_video_out/probe2]
connect_bd_net [get_bd_pins hdmi_vid_out/vid_hblank] [get_bd_pins ila_video_out/probe3]
connect_bd_net [get_bd_pins hdmi_vid_out/vid_vblank] [get_bd_pins ila_video_out/probe5]
connect_bd_net [get_bd_pins hdmi_vid_out/locked] [get_bd_pins ila_video_out/probe8]
connect_bd_net [get_bd_pins hdmi_vid_out/overflow] [get_bd_pins ila_video_out/probe9]
connect_bd_net [get_bd_pins hdmi_vid_out/underflow] [get_bd_pins ila_video_out/probe10]

current_bd_instance /vdma_out_mm2s_user
connect_bd_intf_net [get_bd_intf_pins axi_vdma_mm2s/M_AXI_MM2S] [get_bd_intf_pins axi_mm2s_interconnect/S00_AXI]
connect_bd_intf_net [get_bd_intf_pins M_AXIS_MM2S] [get_bd_intf_pins axi_vdma_mm2s/M_AXIS_MM2S]
connect_bd_intf_net [get_bd_intf_pins M00_AXI] [get_bd_intf_pins axi_mm2s_interconnect/M00_AXI]
connect_bd_intf_net [get_bd_intf_pins S_AXI_LITE] [get_bd_intf_pins axi_vdma_mm2s/S_AXI_LITE]
connect_bd_net [get_bd_pins axi_vdma_mm2s/mm2s_introut] [get_bd_pins mm2s_ila/probe0]
connect_bd_net [get_bd_pins axi_vdma_mm2s/mm2s_frame_ptr_out] [get_bd_pins mm2s_ila/probe1]
connect_bd_net -net ACLK_1 [get_bd_pins Interconnect_ACLK] \
  [get_bd_pins axi_mm2s_interconnect/ACLK] [get_bd_pins axi_mm2s_interconnect/S00_ACLK] \
  [get_bd_pins axi_mm2s_interconnect/M00_ACLK] [get_bd_pins axi_vdma_mm2s/m_axi_mm2s_aclk]
connect_bd_net -net M00_ARESETN_1 [get_bd_pins periphera_ARESETN] \
  [get_bd_pins axi_mm2s_interconnect/M00_ARESETN] [get_bd_pins axi_mm2s_interconnect/S00_ARESETN]
connect_bd_net -net ARESETN_1 [get_bd_pins Interconnect_ARESETN] [get_bd_pins axi_mm2s_interconnect/ARESETN]
connect_bd_net [get_bd_pins s_axi_lite_aclk] [get_bd_pins axi_vdma_mm2s/s_axi_lite_aclk]
connect_bd_net [get_bd_pins axi_resetn] [get_bd_pins axi_vdma_mm2s/axi_resetn]
connect_bd_net -net m_axis_mm2s_aclk_1 [get_bd_pins pix_clk] [get_bd_pins axi_vdma_mm2s/m_axis_mm2s_aclk] [get_bd_pins mm2s_ila/clk]
connect_bd_net [get_bd_pins mm2s_frame_ptr_in] [get_bd_pins axi_vdma_mm2s/mm2s_frame_ptr_in]

current_bd_instance /
connect_bd_intf_net [get_bd_intf_pins HDMI_OUT/S_AXIS] [get_bd_intf_pins vdma_out_mm2s/M_AXIS_MM2S]
connect_bd_intf_net [get_bd_intf_pins Zynq_system/M03_AXI] [get_bd_intf_pins TPG/s_axi_CTRL]
connect_bd_intf_net -intf_net processing_system7_0_DDR [get_bd_intf_ports DDR] [get_bd_intf_pins Zynq_system/DDR]
connect_bd_intf_net -intf_net processing_system7_0_FIXED_IO [get_bd_intf_ports FIXED_IO] [get_bd_intf_pins Zynq_system/FIXED_IO]
connect_bd_intf_net [get_bd_intf_pins vdma_in_s2mm/S_AXIS_S2MM] [get_bd_intf_pins TPG/AXIS_TPG]
connect_bd_intf_net [get_bd_intf_pins vdma_in_s2mm/M00_AXI] [get_bd_intf_pins Zynq_system/S_AXI_HP0]
connect_bd_intf_net [get_bd_intf_pins vdma_out_mm2s/M00_AXI] [get_bd_intf_pins Zynq_system/S_AXI_HP1]
connect_bd_intf_net [get_bd_intf_pins vdma_in_s2mm/S_AXI_LITE] [get_bd_intf_pins Zynq_system/M01_AXI]
connect_bd_intf_net [get_bd_intf_ports TMDS] [get_bd_intf_pins HDMI_OUT/TMDS]
connect_bd_intf_net [get_bd_intf_pins Zynq_system/M02_AXI] [get_bd_intf_pins vdma_out_mm2s/S_AXI_LITE]
connect_bd_intf_net [get_bd_intf_pins HDMI_OUT1/S_AXIS] [get_bd_intf_pins vdma_out_mm2s_user/M_AXIS_MM2S]
connect_bd_intf_net [get_bd_intf_ports TMDS_User] [get_bd_intf_pins HDMI_OUT1/TMDS]
connect_bd_intf_net [get_bd_intf_pins vdma_out_mm2s_user/S_AXI_LITE] [get_bd_intf_pins Zynq_system/M05_AXI]
connect_bd_intf_net -intf_net S_AXI_HP2_1 [get_bd_intf_pins Zynq_system/S_AXI_HP2] [get_bd_intf_pins vdma_out_mm2s_user/M00_AXI]
connect_bd_net -net processing_system7_0_FCLK_CLK0 [get_bd_pins Zynq_system/axi_lite_CLK] \
  [get_bd_pins vdma_out_mm2s/s_axi_lite_aclk] [get_bd_pins vdma_in_s2mm/s_axi_lite_aclk] \
  [get_bd_pins vdma_out_mm2s_user/s_axi_lite_aclk]
connect_bd_net -net rst_ps7_0_50M_peripheral_aresetn [get_bd_pins Zynq_system/axi_lite_ARESETN] \
  [get_bd_pins vdma_out_mm2s/axi_resetn] [get_bd_pins vdma_in_s2mm/axi_resetn] [get_bd_pins vdma_out_mm2s_user/axi_resetn]
connect_bd_net -net pix_clk [get_bd_pins Zynq_system/pix_clk150] \
  [get_bd_pins TPG/pix_clk] [get_bd_pins vdma_in_s2mm/pix_clk] [get_bd_pins vdma_out_mm2s/pix_clk] \
  [get_bd_pins HDMI_OUT/pix_clk] [get_bd_pins HDMI_OUT1/pix_clk] [get_bd_pins vdma_out_mm2s_user/pix_clk]
connect_bd_net -net Zynq_system_peripheral_aresetn [get_bd_pins Zynq_system/per_pix_aresetn150] \
  [get_bd_pins TPG/pix_rst_n] [get_bd_pins HDMI_OUT/pix_aresetn] [get_bd_pins HDMI_OUT1/pix_aresetn]
connect_bd_net -net Zynq_system_FCLK_CLK2 [get_bd_pins Zynq_system/HP_Interconnect_ACLK] \
  [get_bd_pins vdma_in_s2mm/Interconnect_ACLK] [get_bd_pins vdma_out_mm2s/Interconnect_ACLK] \
  [get_bd_pins vdma_out_mm2s_user/Interconnect_ACLK]
connect_bd_net -net M00_ARESETN_1 [get_bd_pins Zynq_system/HP_peripheral_aresetn] \
  [get_bd_pins vdma_out_mm2s/periphera_ARESETN] [get_bd_pins vdma_in_s2mm/periphera_ARESETN] \
  [get_bd_pins vdma_out_mm2s_user/periphera_ARESETN]
connect_bd_net -net ARESETN_1 [get_bd_pins Zynq_system/HP_interconnect_aresetn] \
  [get_bd_pins vdma_in_s2mm/Interconnect_ARESETN] [get_bd_pins vdma_out_mm2s/Interconnect_ARESETN] \
  [get_bd_pins vdma_out_mm2s_user/Interconnect_ARESETN]
connect_bd_net -net vdma_in_s2mm_s2mm_introut [get_bd_pins vdma_in_s2mm/s2mm_interrupt] [get_bd_pins Zynq_system/intr_1]
connect_bd_net -net mm2s_frame_ptr_in_1 [get_bd_pins vdma_in_s2mm/s2mm_frame_ptr_out] [get_bd_pins vdma_out_mm2s/mm2s_frame_ptr_in]

# ---- address map ----
assign_bd_address -offset 0x00000000 -range 1G -target_address_space [get_bd_addr_spaces vdma_in_s2mm/axi_vdma_s2mm/Data_S2MM] [get_bd_addr_segs Zynq_system/processing_system7_0/S_AXI_HP0/HP0_DDR_LOWOCM]
assign_bd_address -offset 0x00000000 -range 1G -target_address_space [get_bd_addr_spaces vdma_out_mm2s/axi_vdma_mm2s/Data_MM2S] [get_bd_addr_segs Zynq_system/processing_system7_0/S_AXI_HP1/HP1_DDR_LOWOCM]
assign_bd_address -offset 0x00000000 -range 1G -target_address_space [get_bd_addr_spaces vdma_out_mm2s_user/axi_vdma_mm2s/Data_MM2S] [get_bd_addr_segs Zynq_system/processing_system7_0/S_AXI_HP2/HP2_DDR_LOWOCM]
assign_bd_address -offset 0x43000000 -range 64K -target_address_space [get_bd_addr_spaces Zynq_system/processing_system7_0/Data] [get_bd_addr_segs vdma_in_s2mm/axi_vdma_s2mm/S_AXI_LITE/Reg]
assign_bd_address -offset 0x43010000 -range 64K -target_address_space [get_bd_addr_spaces Zynq_system/processing_system7_0/Data] [get_bd_addr_segs vdma_out_mm2s/axi_vdma_mm2s/S_AXI_LITE/Reg]
assign_bd_address -offset 0x43030000 -range 64K -target_address_space [get_bd_addr_spaces Zynq_system/processing_system7_0/Data] [get_bd_addr_segs vdma_out_mm2s_user/axi_vdma_mm2s/S_AXI_LITE/Reg]
assign_bd_address -offset 0x43C00000 -range 64K -target_address_space [get_bd_addr_spaces Zynq_system/processing_system7_0/Data] [get_bd_addr_segs TPG/v_tpg/s_axi_CTRL/Reg]

validate_bd_design
save_bd_design
